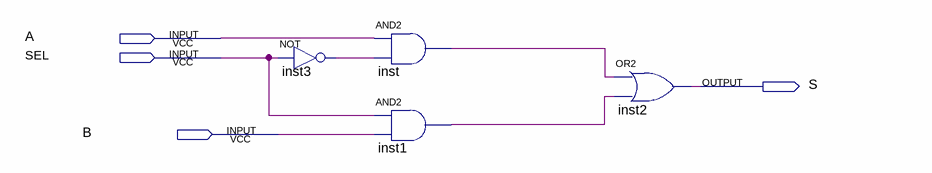
[diagram p0: schematic sheet]
// Quartus schematic LAB4.bdf as structural Verilog: 4 symbols, 4 pins
module LAB4 (
  input  A,
  input  SEL,
  input  B,
  output S
);

  wire inst1_out, inst3_out, inst_out;

  not inst3 (inst3_out, SEL);
  and inst (inst_out, A, inst3_out);
  and inst1 (inst1_out, SEL, B);
  or inst2 (S, inst_out, inst1_out);
endmodule
